# Altium schematic sheet 2.SchDoc
size OrCAD E
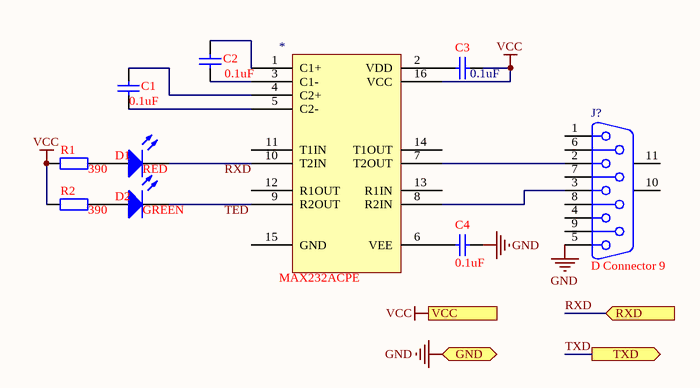
[diagram p0: 2.SchDoc]

## Parts
*  MAX232ACPE
C1  value 0.1uF  [0402]  (hidden comment: Cap Semi)
C2  value 0.1uF  [0402]  (hidden comment: Cap Semi)
C3  value 0.1uF  [0402]  (hidden comment: Cap Semi)
C4  value 0.1uF  [0402]  (hidden comment: Cap Semi)
D1  RED  [3.2X1.6X1.1]
D2  GREEN  [3.2X1.6X1.1]
J?  D Connector 9  [DSUB1.385-2H9]
R1  value 390  [AXIAL-0.4]  (hidden comment: Res2)
R2  value 390  [AXIAL-0.4]  (hidden comment: Res2)

## Ports
GND (bidir), RXD (in), TXD (out), VCC (in)

## Nets
GND: C4.2 J?.5 ; port GND
VCC: *.16(VCC) C3.1 R1.1 R2.1 ; port VCC
RXD: port RXD
TXD: port TXD
Net*_1: *.1(C1+) C2.2
Net*_2: *.2(VDD) C3.2
Net*_3: *.3(C1-) C2.1
Net*_4: *.4(C2+) C1.2
Net*_5: *.5(C2-) C1.1
Net*_6: *.6(VEE) C4.1
Net*_7: *.7(T2OUT) J?.2
Net*_8: *.8(R2IN) J?.3
Net*_9: *.9(R2OUT) D2.2(K)
Net*_10: *.10(T2IN) D1.2(K)
NetD1_1: D1.1(A) R1.2
NetD2_1: D2.1(A) R2.2

Not connected (* = marked no-connect by the designer): * 11(T1IN) 12(R1OUT) 13(R1IN) 14(T1OUT) 15(GND); J? 1 4 6 7 8 9 10(MH1) 11(MH2)

## Notes on the sheet
- Labels drawn without touching a wire or pin: RXD, TED

## Library data of the parts
C1-C4 = Cap Semi: Capacitor (Semiconductor SIM Model); Published: 8-Jun-2000; LatestRevisionDate: 29-May-2009; LatestRevisionNote: IPC-7351 Footprint Added.; PackageReference: C1206; Publisher: Altium Limited; PackageDescription: Chip Capacitor
D1 D2 = LED2: Typical RED, GREEN, YELLOW, AMBER GaAs LED; Published: 8-Jun-2000; LatestRevisionDate: 17-Jul-2002; LatestRevisionNote: Re-released for DXP Platform.; PackageVersion: Feb-2002; PackageReference: 3.2X1.6X1.1; Publisher: Altium Limited; PackageDescription: SM LED; 2 Flat Leads
J? = D Connector 9: Receptacle Assembly, 9 Position, Right Angle; PackageDocument: O; Positions: 9; Published: 15-Jun-2001; LatestRevisionDate: 17-Jul-2002; LatestRevisionNote: Re-released for DXP Platform.; DatasheetDocument: 1-Sep-1999; PackageReference: 788750; Publisher: Altium Limited; Orientation: Right Angle; Gender: Receptacle
R1 R2 = Res2: Resistor; Published: 8-Jun-2000; LatestRevisionDate: 17-Jul-2002; LatestRevisionNote: Re-released for DXP Platform.; PackageReference: AXIAL-0.4; Publisher: Altium Limited; PackageDescription: Axial Device, Thru-Hole; 2 Leads; 0.4 in Pin Spacing